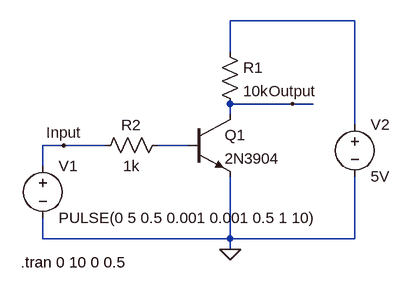
[diagram p0: schematic Porte_logique_NON.asc]
Porte_logique_NON.asc, the LTspice schematic file:
Version 4
SHEET 1 880 680
WIRE 416 -48 224 -48
WIRE 224 0 224 -48
WIRE 320 80 224 80
WIRE 352 80 320 80
WIRE 224 96 224 80
WIRE 416 112 416 -48
WIRE -32 144 -64 144
WIRE 32 144 -32 144
WIRE 160 144 112 144
WIRE -64 176 -64 144
WIRE -64 288 -64 256
WIRE 224 288 224 192
WIRE 224 288 -64 288
WIRE 416 288 416 192
WIRE 416 288 224 288
WIRE 224 304 224 288
FLAG 224 304 0
FLAG 320 80 Output
FLAG -32 144 Input
SYMBOL npn 160 96 R0
SYMATTR InstName Q1
SYMATTR Value 2N3904
SYMBOL res 208 -16 R0
SYMATTR InstName R1
SYMATTR Value 10k
SYMBOL res 128 128 R90
WINDOW 0 0 56 VBottom 2
WINDOW 3 32 56 VTop 2
SYMATTR InstName R2
SYMATTR Value 1k
SYMBOL voltage -64 160 R0
WINDOW 123 0 0 Left 0
WINDOW 39 0 0 Left 0
SYMATTR InstName V1
SYMATTR Value PULSE(0 5 0.5 0.001 0.001 0.5 1 10)
SYMBOL voltage 416 96 R0
WINDOW 123 0 0 Left 0
WINDOW 39 0 0 Left 0
SYMATTR InstName V2
SYMATTR Value 5V
TEXT -98 324 Left 2 !.tran 0 10 0 0.5

The netlist it stands for:
* Porte_logique_NON.asc
Q1 Output N002 0 0 2N3904
R1 N001 Output 10k
R2 N002 Input 1k
V1 Input 0 PULSE(0 5 0.5 0.001 0.001 0.5 1 10)
V2 N001 0 5V
.model NPN NPN
.model PNP PNP
.lib standard.bjt
.tran 0 10 0 0.5
.backanno
.end

* Results of the author's LTspice run, read from the files saved beside the schematic
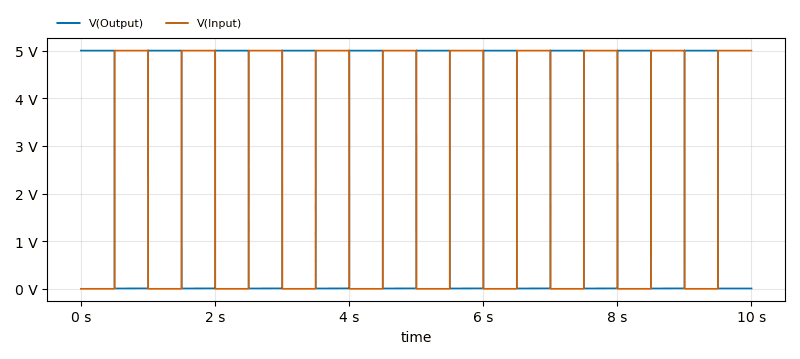
[diagram p1: Transient Analysis of Porte_logique_NON.asc, plotted from the saved traces]
* Transient Analysis, 1 run:
*   V(Output): min 7.239 mV, max 5.005 V, average 2.496 V, rms 3.53 V, last 7.239 mV
*   V(Input): min 0 V, max 5 V, average 2.504 V, rms 3.537 V, last 5 V